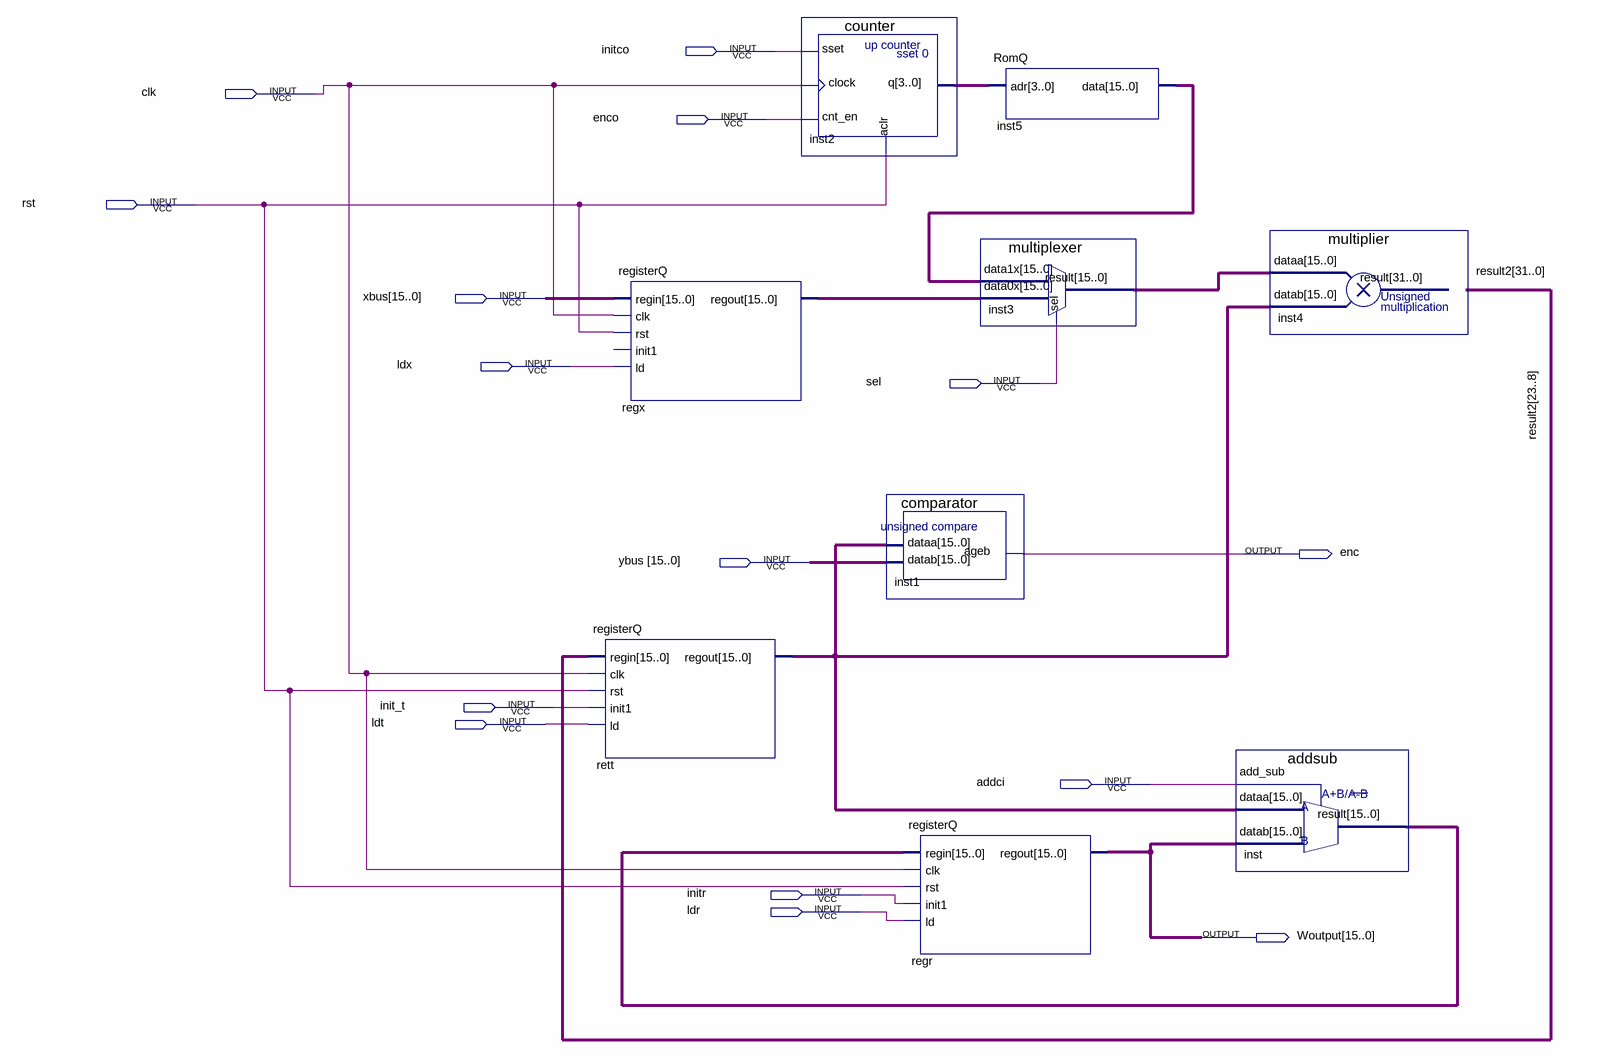
[diagram p0: schematic sheet]
// Quartus schematic datapathQfinal.bdf as structural Verilog: 9 symbols, 15 pins
module datapathQfinal (
  input  initco,
  input  clk,
  input  enco,
  input  rst,
  input  [15:0] xbus,
  input  ldx,
  input  sel,
  input  [15:0] ybus,
  input  init_t,
  input  ldt,
  input  addci,
  input  initr,
  input  ldr,
  output enc,
  output [15:0] Woutput
);

  wire [3:0] inst2_q;
  wire [15:0] inst3_result, inst5_data, inst_result, regx_regout, rett_regout;
  wire [31:0] result2;

  registerQ regx (.regin(xbus), .clk(clk), .rst(rst), .ld(ldx), .regout(regx_regout));  // open: init1
  registerQ rett (.regin(result2[23:8]), .clk(clk), .rst(rst), .init1(init_t), .ld(ldt), .regout(rett_regout));
  counter inst2 (.sset(initco), .clock(clk), .cnt_en(enco), .aclr(rst), .q(inst2_q));
  comparator inst1 (.dataa(rett_regout), .datab(ybus), .ageb(enc));
  registerQ regr (.regin(inst_result), .clk(clk), .rst(rst), .init1(initr), .ld(ldr), .regout(Woutput));
  RomQ inst5 (.adr(inst2_q), .data(inst5_data));
  multiplexer inst3 (.data1x(inst5_data), .data0x(regx_regout), .sel(sel), .result(inst3_result));
  multiplier inst4 (.dataa(inst3_result), .datab(rett_regout), .result(result2));
  addsub inst (.add_sub(addci), .dataa(rett_regout), .datab(Woutput), .result(inst_result));
endmodule
